# Altium schematic sheet [02] - BLOCK DIAGRAM.SchDoc
size A2; DocumentNumber: 2; SheetNumber: 2; SheetTotal: 6; PageSetup: Record=PageOptions|CenterHorizontal=True|CenterVertical=True|PrintScale=0.52|XCorrection=1.00|YCorrection=1.00|PrintKind=1|BorderSize=5000000|LeftOffset=0|BottomOffset=0|Orientation=2|PaperLength=1000|PaperWidth=1000|Scale=100|PaperSource=4|PrintQuality=600|MediaType=1|DitherType=10|PrintScaleMode=1|PaperKind=A4|PaperIndex=9
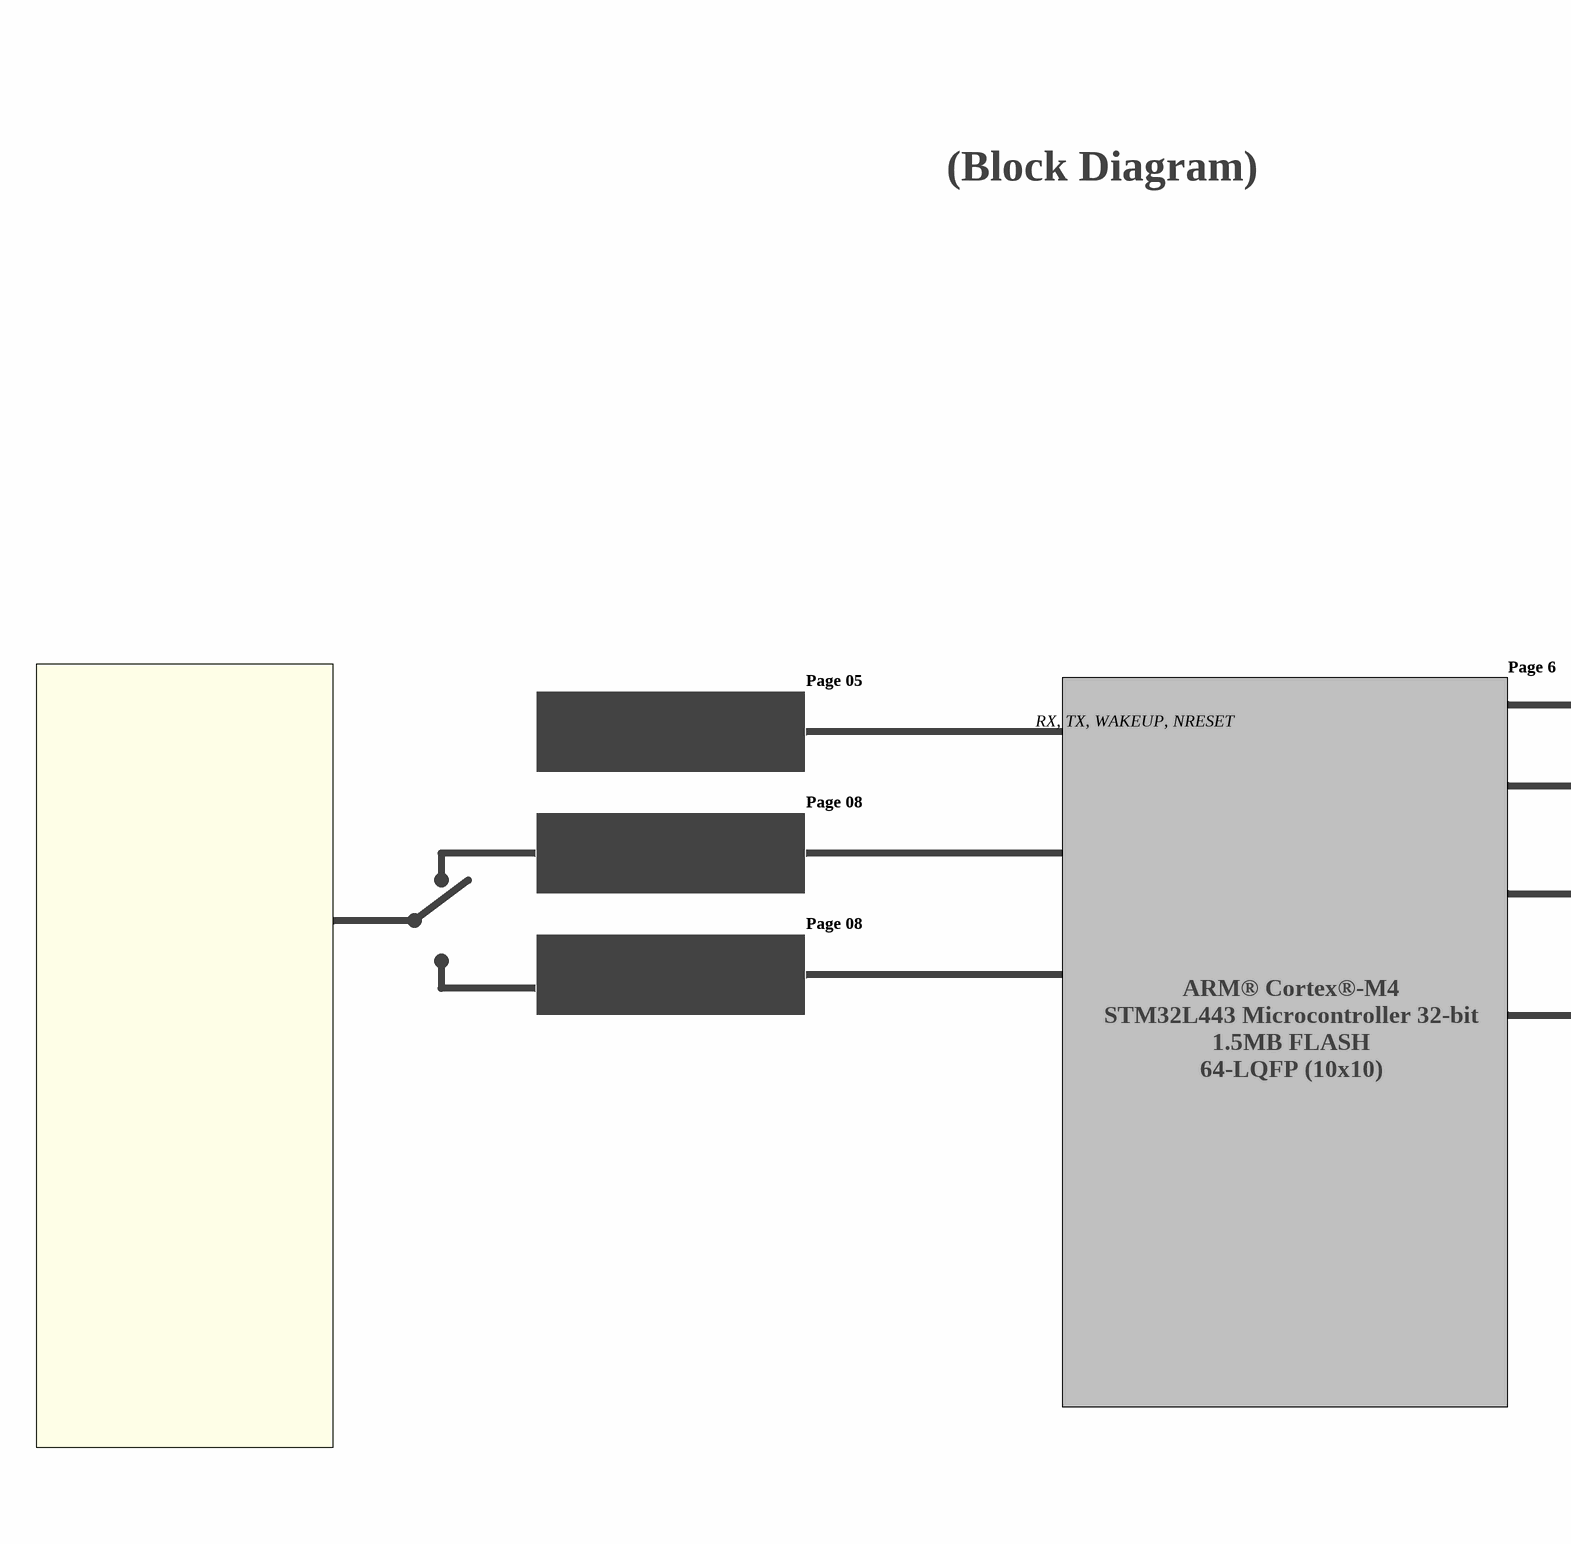
[diagram p0: [02] - BLOCK DIAGRAM.SchDoc, left]
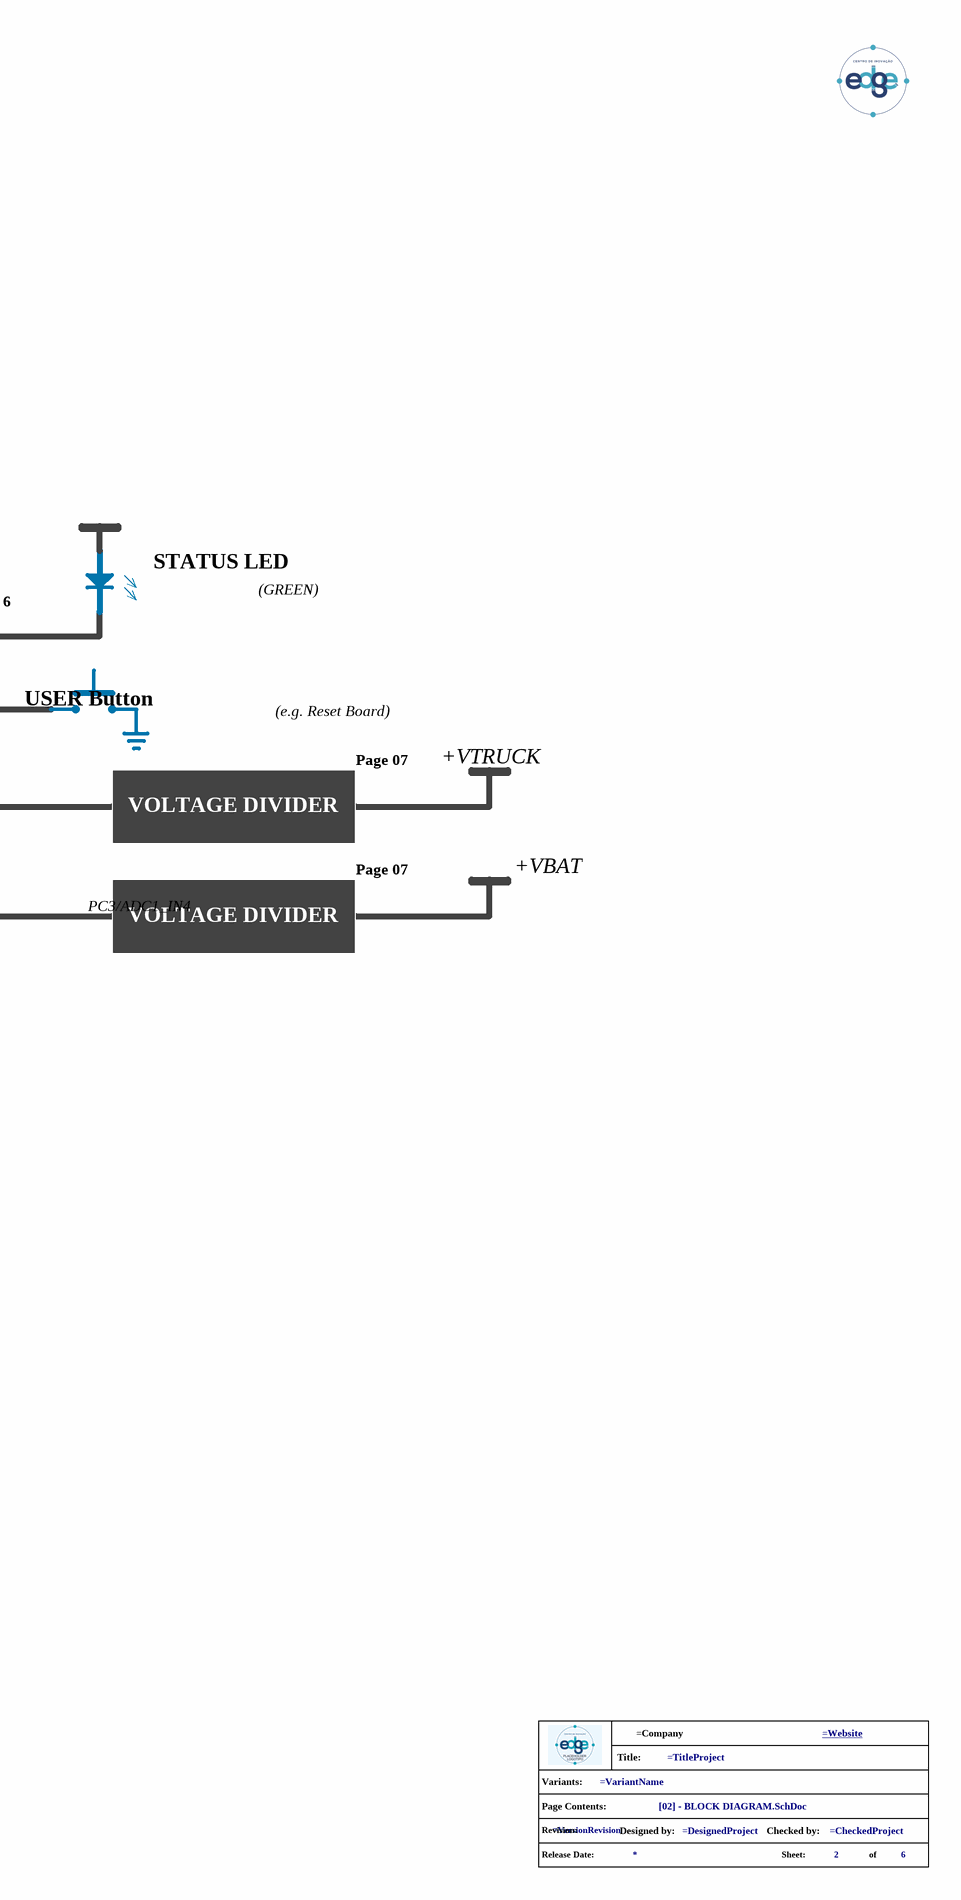
[diagram p1: [02] - BLOCK DIAGRAM.SchDoc, right]

## Parts
*?  info_project  (value not drawn)  (graphical)

## Notes on the sheet
- (Block Diagram)
- STATUS LED
- Page 05
- Page 6
- (GREEN)
- RX, TX, WAKEUP, NRESET
- USER Button
- Page 08
- (e.g. Reset Board)
- Page 07
- +VTRUCK
- VOLTAGE DIVIDER
- ARM® Cortex®-M4
- +VBAT
- STM32L443 Microcontroller 32-bit
- 1.5MB FLASH
- PC3/ADC1_IN4
- 64-LQFP (10x10)
- (in symbol info_project) Title:; Variants:; Page Contents:; Revision:; Designed by:; Checked by:; Release Date:; Sheet:; of